# Altium schematic sheet GCI_1.0.SchDoc
size A2
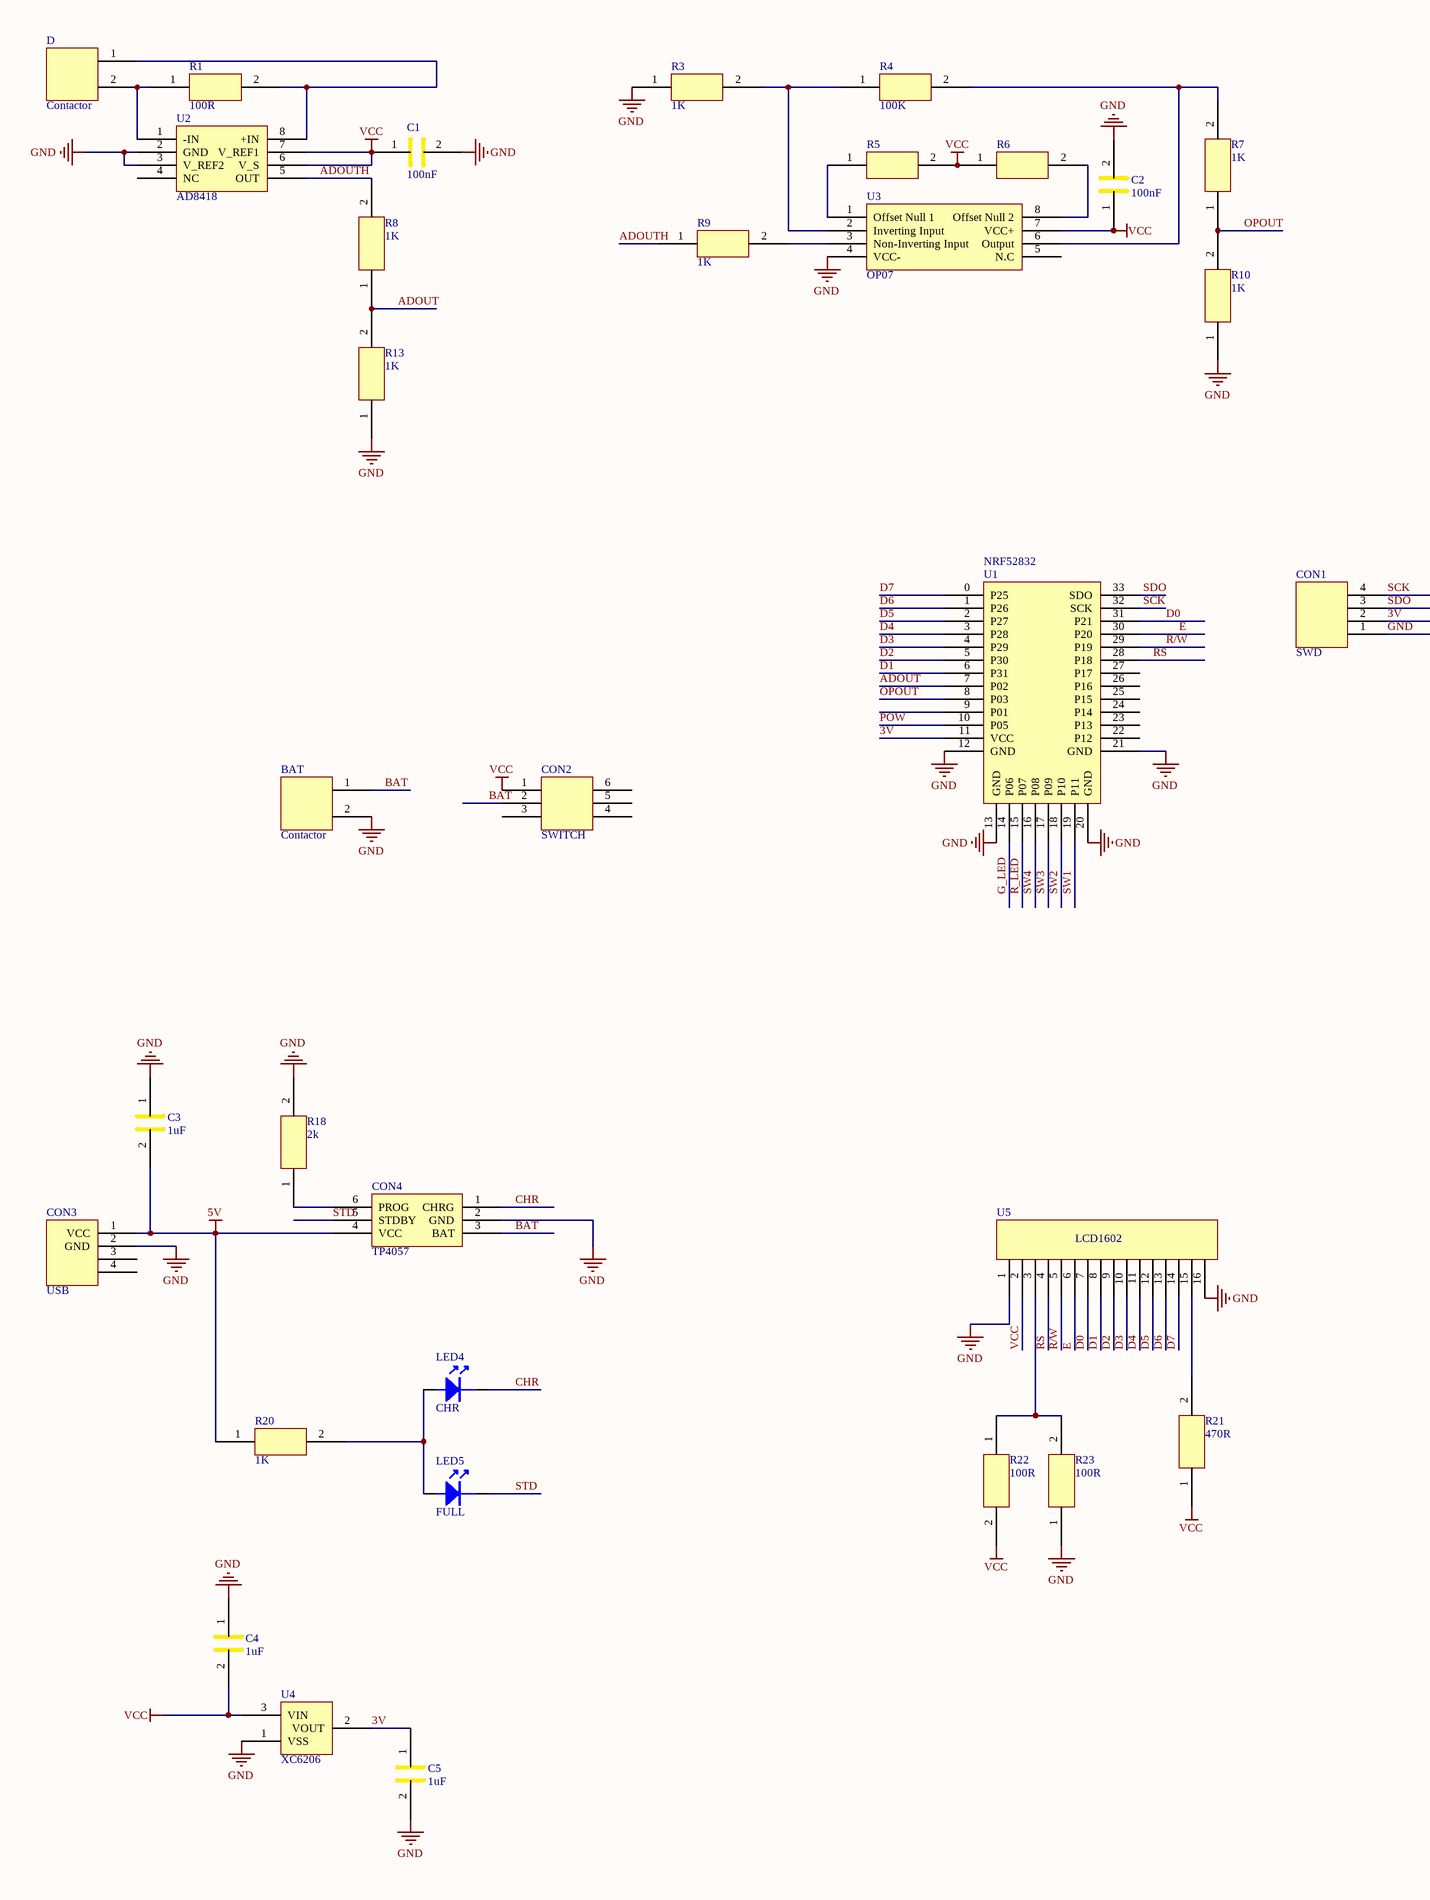
[diagram p0: GCI_1.0.SchDoc, left]
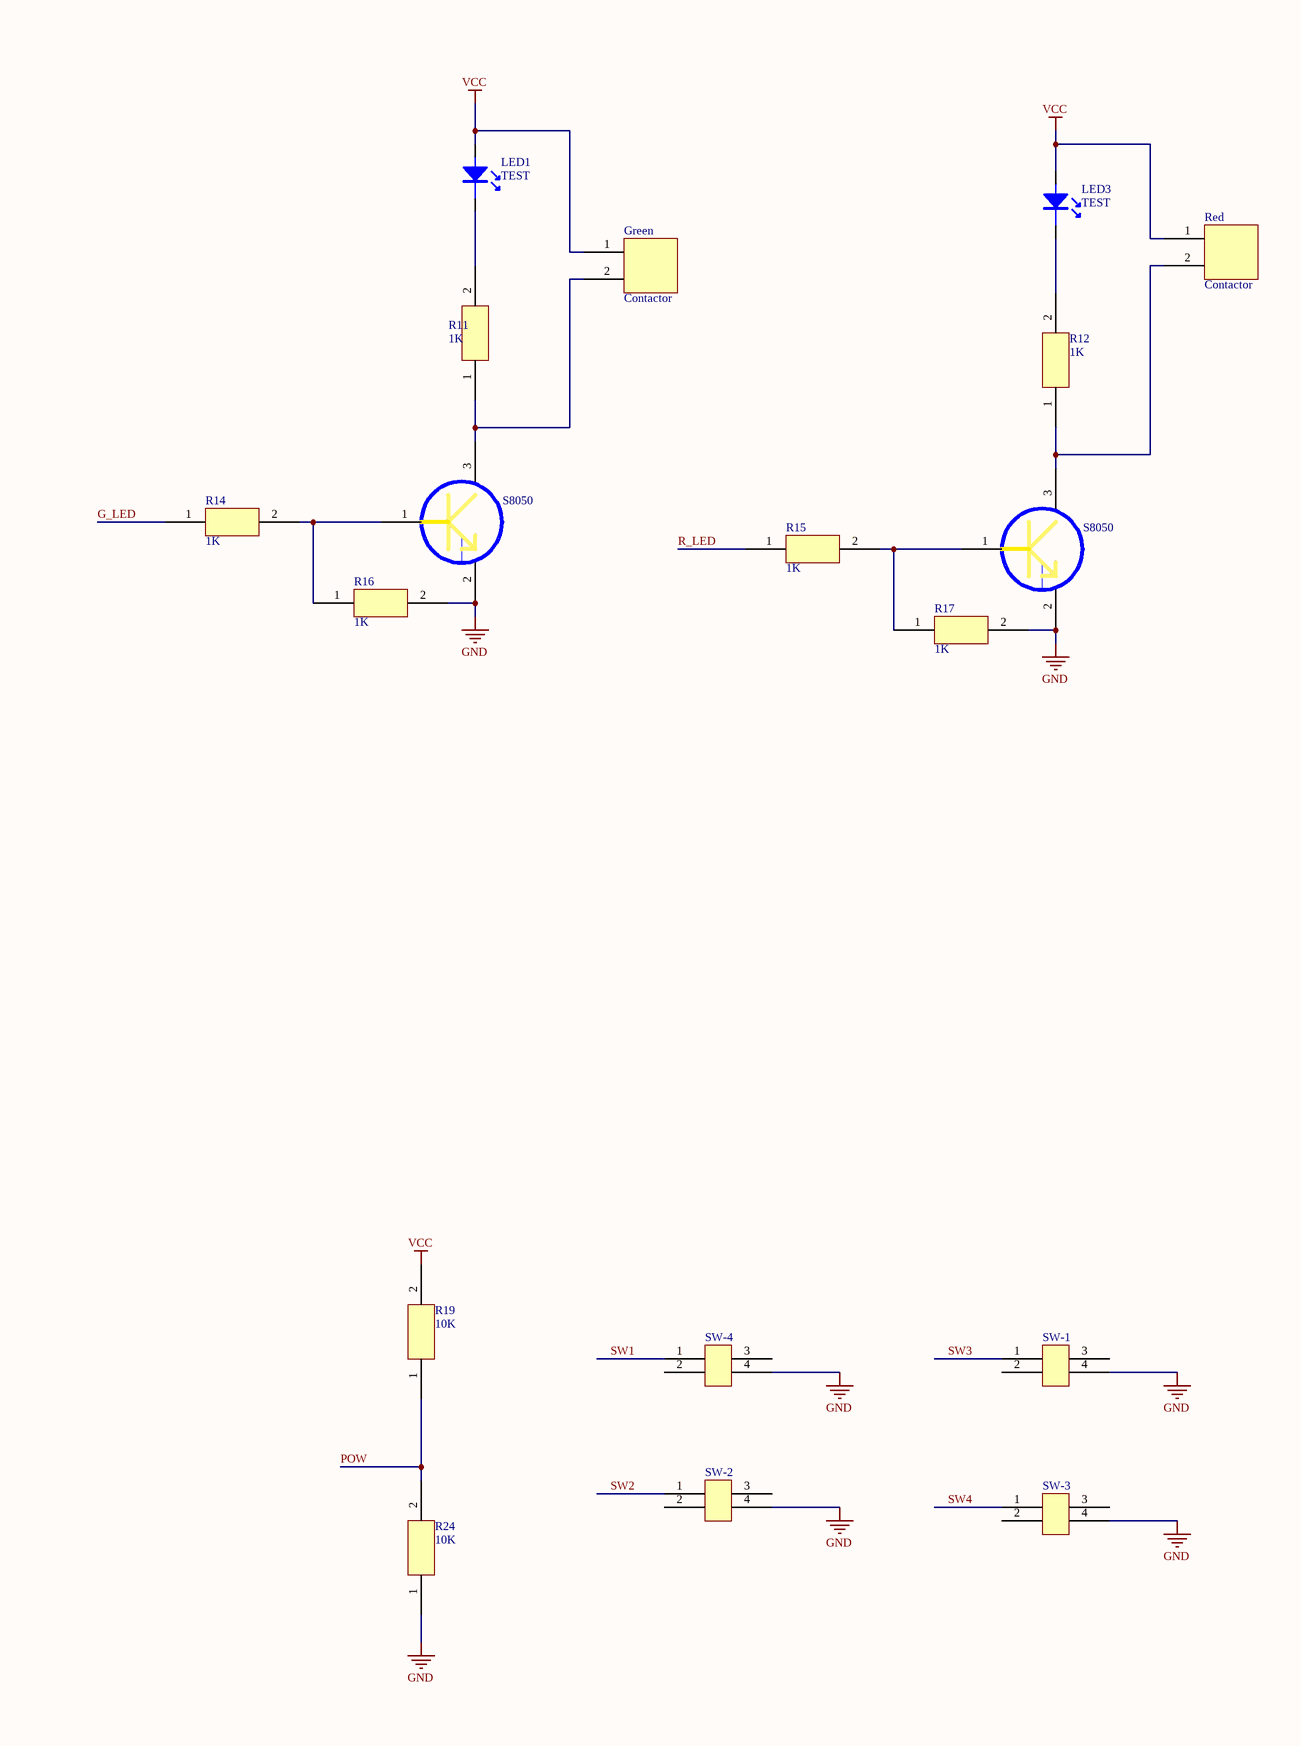
[diagram p1: GCI_1.0.SchDoc, right]

## Parts
*  S8050  [SOT-23-S-1]
*3  S8050  [SOT-23-S-1]
BAT  Contactor
C1  100nF  [0603C]
C2  100nF  [0603C]
C3  1uF  [0603C]
C4  1uF  [0603C]
C5  1uF  [0603C]
CON1  SWD  [SIP-4P]
CON2  SWITCH
CON3  USB  [USB]
CON4  TP4057  [SOT23-6-SMALL]
D  Contactor
Green  Contactor
LED1  TEST  [0603LED]
LED3  TEST  [0603LED]
LED4  CHR  [0603LED]
LED5  FULL  [0603LED]
R1  100R  [2512]
R3  1K  [0603R]
R4  100K  [0603R]
R5  (no value)  [0603R]
R6  (no value)  [0603R]
R7  1K  [0603R]
R8  1K  [0603R]
R9  1K  [0603R]
R10  1K  [0603R]
R11  1K  [0603R]
R12  1K  [0603R]
R13  1K  [0603R]
R14  1K  [0603R]
R15  1K  [0603R]
R16  1K  [0603R]
R17  1K  [0603R]
R18  2k  [0603R]
R19  10K  [0603R]
R20  1K  [0603R]
R21  470R  [0603R]
R22  100R  [0603R]
R23  100R  [0603R]
R24  10K  [0603R]
Red  Contactor
SW-1  SW?  [Key4X4]  (value not drawn)
SW-2  SW?  [Key4X4]  (value not drawn)
SW-3  SW?  [Key4X4]  (value not drawn)
SW-4  SW?  [Key4X4]  (value not drawn)
U1  NRF52832  [NRF52832_MODEL]
U2  AD8418
U3  OP07
U4  XC6206  [SOT-23-S-1]
U5  LCD1602  [LCD1602_S]

## Nets
5V: C3.2 CON3.1(VCC) CON4.4(VCC) R20.1
GND: *.2 *3.2 BAT.2 C1.2 C2.2 C3.1 C4.1 C5.2 CON1.1 CON3.2(GND) CON4.2(GND) R3.1 R10.1 R13.1 R16.2 R17.2 R18.2 R23.1 R24.1 SW-1.4 SW-2.4 SW-3.4 SW-4.4 U1.12(GND) U1.13(GND) U1.20(GND) U1.21(GND) U2.2(GND) U2.3(V_REF2) U3.4(VCC-) U4.1(VSS) U5.1 U5.16
VCC: C1.1 C2.1 C4.2 CON2.1 Green.1 LED1.A LED3.A R5.2 R6.1 R19.2 R21.1 R22.2 Red.1 U2.6(V_S) U2.7(V_REF1) U3.7(VCC+) U4.3(VIN) U5.2
3V: C5.1 CON1.2 U1.11(VCC) U4.2(VOUT)
ADOUT: R8.1 R13.2 U1.7(P02)
ADOUTH: R8.2 R9.1 U2.5(OUT)
BAT: BAT.1 CON2.2 CON4.3(BAT)
CHR: CON4.1(CHRG) LED4.K
D0: U1.31(P21) U5.7
D1: U1.6(P31) U5.8
D2: U1.5(P30) U5.9
D3: U1.4(P29) U5.10
D4: U1.3(P28) U5.11
D5: U1.2(P27) U5.12
D6: U1.1(P26) U5.13
D7: U1.0(P25) U5.14
E: U1.30(P20) U5.6
G_LED: R14.1 U1.14(P06)
OPOUT: R7.1 R10.2 U1.8(P03)
POW: R19.1 R24.2 U1.10(P05)
R/W: U1.29(P19) U5.5
R_LED: R15.1 U1.15(P07)
RS: U1.28(P18) U5.4
SCK: CON1.4 U1.32(SCK)
SDO: CON1.3 U1.33(SDO)
STD: CON4.5(STDBY) LED5.K
SW1: U1.19(P11)
SW2: U1.18(P10)
SW3: U1.17(P09)
SW4: U1.16(P08)
Net*3_1: *3.1(VSS) R15.2 R17.1
Net*3_3: *3.3 R12.1 Red.2
Net*_1: *.1(VSS) R14.2 R16.1
Net*_3: *.3 Green.2 R11.1
NetCON4_6: CON4.6(PROG) R18.1
NetD_1: D.1 R1.2 U2.8(+IN)
NetD_2: D.2 R1.1 U2.1(-IN)
NetLED1_K: LED1.K R11.2
NetLED3_K: LED3.K R12.2
NetLED4_A: LED4.A LED5.A R20.2
NetR3_2: R3.2 R4.1 U3.2(Inverting_Input)
NetR4_2: R4.2 R7.2 U3.6(Output)
NetR5_1: R5.1 U3.1(Offset_Null_1)
NetR6_2: R6.2 U3.8(Offset_Null_2)
NetR9_2: R9.2 U3.3(Non-Inverting_Input)
NetR21_2: R21.2 U5.15
NetR22_1: R22.1 R23.2 U5.3

Not connected (* = marked no-connect by the designer): CON2 3 4 5 6; CON3 3 4; SW-1 1(*) 2(*) 3(*); SW-2 1(*) 2(*) 3(*); SW-3 1(*) 2(*) 3(*); SW-4 1(*) 2(*) 3(*); U1 9(P01) 22(P12) 23(P13) 24(P14) 25(P15) 26(P16) 27(P17); U2 4(NC); U3 5(N.C)

## Library data of the parts
C1-C5 = Cap
CON1 = Contactor_1
CON2 = CON6
LED1 LED3-LED5 = LED
R1 R3-R24 = Resistance
SW-1-SW-4 = SW-4